# EAGLE design tag (EAGLE 9.0.0)
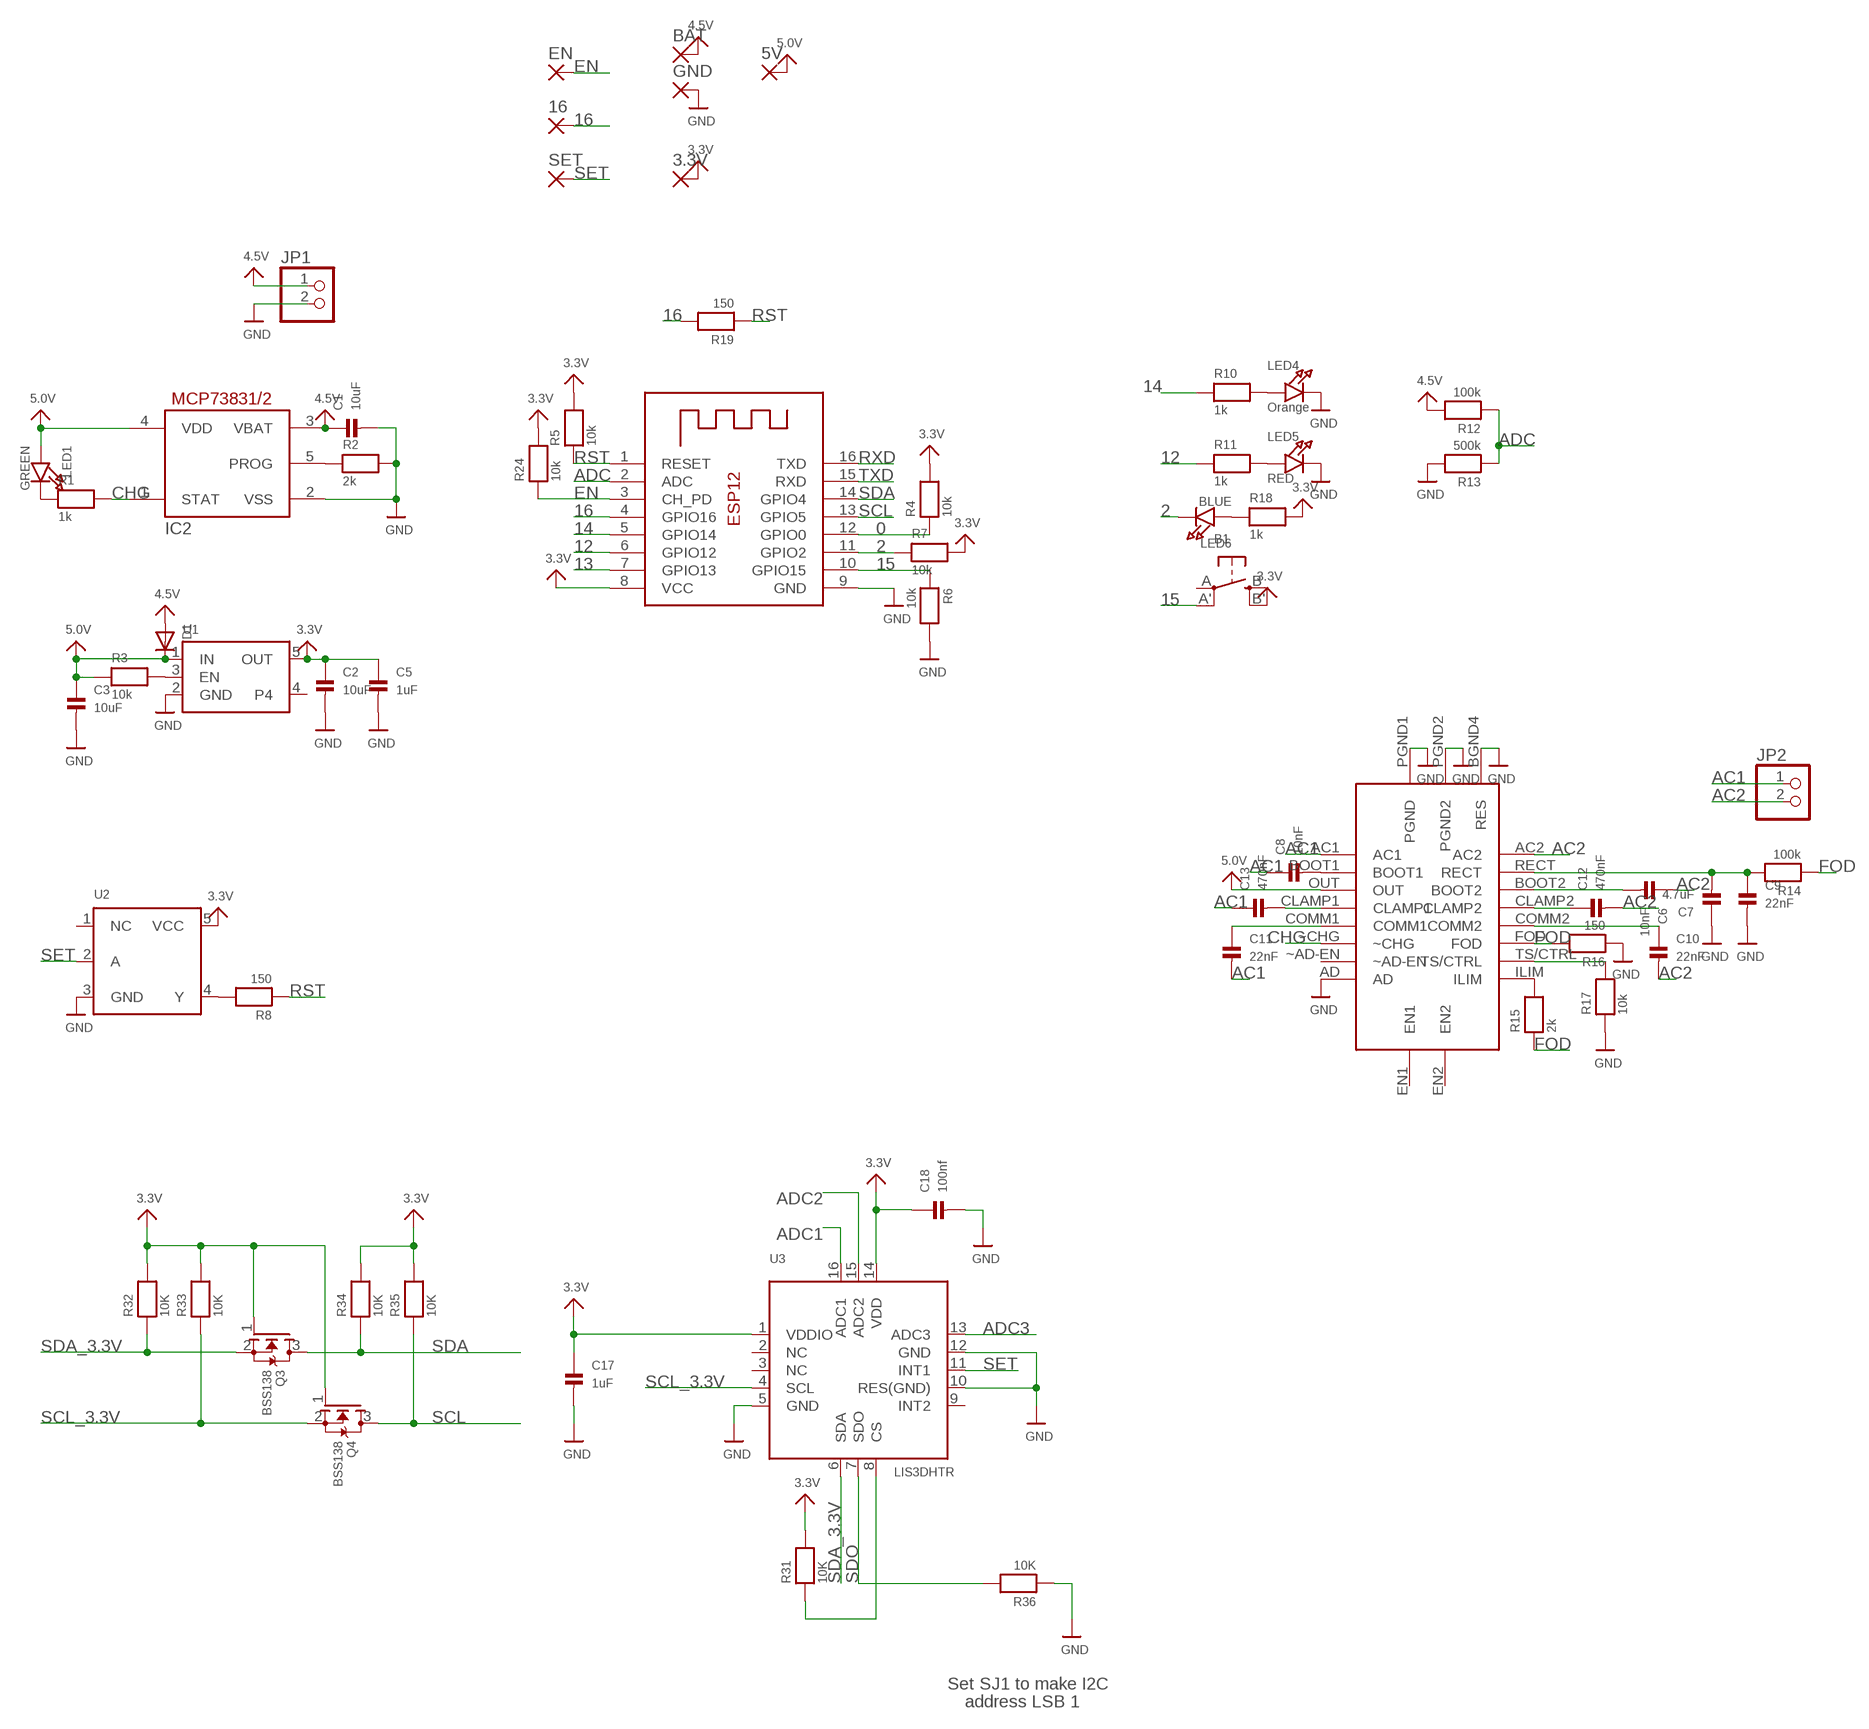
[diagram p0: schematic, sheet 1]

## Parts
3.3V  SMD2  [SMD1,27-2,54]
5V  SMD2  [SMD1,27-2,54]
16  SMD2  [SMD1,27-2,54]
B1  SWITCH_TACT_SMT4.6X2.8  [BTN_KMR2_4.6X2.8]
BAT  SMD2  [SMD1,27-2,54]
C1  10uF  CAP_CERAMIC0603  [0603]
C2  10uF  CAP_CERAMIC0603  [0603]
C3  10uF  CAP_CERAMIC0603  [0603]
C5  1uF  CAP_CERAMIC0402  [0402]
C6  10nF  CAP_CERAMIC0402  [0402]
C7  4.7uF  CAP_CERAMIC0603  [0603]
C8  10nF  CAP_CERAMIC0402  [0402]
C9  22nF  CAP_CERAMIC0402  [0402]
C10  22nF  CAP_CERAMIC0402  [0402]
C11  22nF  CAP_CERAMIC0402  [0402]
C12  470nF  CAP_CERAMIC0402  [0402]
C13  470nF  CAP_CERAMIC0402  [0402]
C17  1uF  CAP_CERAMIC0402  [0402]
C18  100nf  CAP_CERAMIC0402  [0402]
D1  DIODESOD-123  [SOD-123]
EN  SMD2  [SMD1,27-2,54]
GND  SMD2  [SMD1,27-2,54]
IC2  MCP73831/OT  [SOT23-5L]
JP1  HEADER-1X2  [1X02_OVAL]
JP2  HEADER-1X2  [1X02_OVAL]
LED1  GREEN  LED0603  [CHIPLED_0603]
LED4  Orange  LED0603  [CHIPLED_0603]
LED5  RED  LED0603  [CHIPLED_0603]
LED6  BLUE  LED0603  [CHIPLED_0603]
Q3  BSS138  MOSFET-NWIDE  [SOT23-WIDE]
Q4  BSS138  MOSFET-NWIDE  [SOT23-WIDE]
R1  1k  RESISTOR0402  [0402]
R2  2k  RESISTOR0402  [0402]
R3  10k  RESISTOR0402  [0402]
R4  10k  RESISTOR0402  [0402]
R5  10k  RESISTOR0402  [0402]
R6  10k  RESISTOR0402  [0402]
R7  10k  RESISTOR0402  [0402]
R8  150  RESISTOR0402  [0402]
R10  1k  RESISTOR0402  [0402]
R11  1k  RESISTOR0402  [0402]
R12  100k  RESISTOR0402  [0402]
R13  500k  RESISTOR0402  [0402]
R14  100k  RESISTOR0402  [0402]
R15  2k  RESISTOR0402  [0402]
R16  150  RESISTOR0402  [0402]
R17  10k  RESISTOR0402  [0402]
R18  1k  RESISTOR0402  [0402]
R19  150  RESISTOR0402  [0402]
R24  10k  RESISTOR0402  [0402]
R31  10K  RESISTOR0402  [0402]
R32  10K  RESISTOR0402  [0402]
R33  10K  RESISTOR0402  [0402]
R34  10K  RESISTOR0402  [0402]
R35  10K  RESISTOR0402  [0402]
R36  10K  RESISTOR0402  [0402]
SET  SMD2  [SMD1,27-2,54]
U1  VREG_SOT23-5  [SOT23-5]
U2  74LVC1G04  [SOT23-5]
U3  LIS3DHTR  ACCEL_LIS3DHTR  [LGA16_3X3MM]
U$1  BQ51013B  [VQFN]
X1  ESP-12  [ESP-12]

## Nets
0: R4.1 X1.12(GPIO0)
2: LED6.C R7.1 X1.11(GPIO2)
3.3V: 3.3V.1(P) B1.B'(S1) C2.1 C5.1 C17.1 C18.1 Q3.1(G) Q4.1(G) R4.2 R5.2 R7.2 R18.2 R24.2 R31.2 R32.2 R33.2 R34.2 R35.2 U1.5(OUT) U2.5(VCC) U3.1(VDDIO) U3.14(VDD) X1.8(VCC)
4.5V: BAT.1(P) C1.1 D1.A IC2.3(VBAT) JP1.1 R12.2
5.0V: 5V.1(P) C3.1 D1.C IC2.4(VDD) LED1.A R3.1 U1.1(IN) U$1.OUT
12: R11.1 X1.6(GPIO12)
13: X1.7(GPIO13)
14: R10.1 X1.5(GPIO14)
15: B1.A'(P1) R6.1 X1.10(GPIO15)
16: 16.1(P) R19.2 X1.4(GPIO16)
AC1: C8.1 C11.2 C13.1 JP2.1 U$1.AC1
AC2: C6.1 C10.2 C12.2 JP2.2 U$1.AC2
ADC: R12.1 R13.1 X1.2(ADC)
ADC1: U3.16(ADC1)
ADC2: U3.15(ADC2)
ADC3: U3.13(ADC3)
CHG: IC2.1(STAT) R1.2 U$1.~CHG
EN: EN.1(P) R24.1 X1.3(CH_PD)
FOD: R14.1 R15.1 R16.2 U$1.FOD
GND: C1.2 C2.2 C3.2 C5.2 C7.1 C9.2 C17.2 C18.2 GND.1(P) IC2.2(VSS) JP1.2 LED4.C LED5.C R2.2 R6.2 R13.2 R16.1 R17.1 R36.1 U1.2(GND) U2.3(GND) U3.5(GND) U3.10(RES(GND)) U3.12(GND) U$1.AD U$1.BGND4(RES) U$1.PGND1(PGND) U$1.PGND2 X1.9(GND)
N$1: C11.1 U$1.COMM1
N$2: LED1.C R1.1
N$3: IC2.5(PROG) R2.1
N$4: LED6.A R18.1
N$5: R3.2 U1.3(EN)
N$6: R8.2 U2.4(Y)
N$11: R31.1 U3.8(CS)
N$12: LED4.A R10.2
N$13: LED5.A R11.2
N$14: C8.2 U$1.BOOT1
N$15: C6.2 U$1.BOOT2
N$16: C7.2 C9.1 R14.2 U$1.RECT
N$17: R15.2 U$1.ILIM
N$18: R17.2 U$1.TS/CTRL
N$19: C10.1 U$1.COMM2
N$20: C13.2 U$1.CLAMP1
N$22: C12.1 U$1.CLAMP2
RST: R5.1 R8.1 R19.1 X1.1(RESET)
RXD: X1.16(TXD)
SCL: Q4.3(D) R35.1 X1.13(GPIO5)
SCL_3.3V: Q4.2(S) R33.1 U3.4(SCL)
SDA: Q3.3(D) R34.1 X1.14(GPIO4)
SDA_3.3V: Q3.2(S) R32.1 U3.6(SDA)
SDO: R36.2 U3.7(SDO)
SET: SET.1(P) U2.2(A) U3.11(INT1)
TXD: X1.15(RXD)
Unconnected: B1.A(P) B1.B(S) U1.4 U2.1(NC) U3.2(NC) U3.3(NC) U3.9(INT2) U$1.EN1 U$1.EN2 U$1.~AD-EN

## Notes on the sheet
- Set SJ1 to make I2C
- address LSB 1

## Library data of the parts
3.3V 5V 16 BAT EN GND SET = wirepad:SMD2: SMD PAD
B1 = microbuilder:SWITCH_TACT_SMT: SMT Tact Switches 6x6mm - Digikey: P12940SCT-ND KMR2 (4.6x2.8mm) - Digikey: 401-1426-1-ND EVQ-PQHB55 - Light Touch, 160GF (4.5x4.5mm) - Digikey: P8090SCT-ND
C1-C3 C5-C13 C17 C18 = microbuilder:CAP_CERAMIC: Ceramic Capacitors 0402 - 0402 Surface Mount Capacitors 16pF 50V 5% [Digikey: 445-4899-2-ND] 18pF 50V 5% [Digikey: 490-1281-2-ND] 22pF 50V 5% [Digikey: 490-1283-2-ND] 68pF 50V 5% [Digikey: 490-1289-2-ND] 0.1uF 10V 10% [Digikey: 490-1318-2-ND] 1.0uF 6.3V 10% [Digikey: 490-1320-2-ND] 0603 - 0603 Surface Mount Capacitors 16 pF 50V 5% [Digikey: 445-5051-2-ND] 22 pF 50V [Digikey: PCC220ACVTR-ND] 33 pF 50V 5% [Digikey: 490-1415-1-ND] 56pF 50V 5% [Digikey: 490-1421-1-ND] 220pF 50V 5% [Digikey: 445-1285-1-ND] 680 pF 50V 2200 pF 50V 5% C0G [Digikey: 445-1297-1-ND] 5600 pF 100V 5% X7R [Digikey: 478-3711-1-ND] 0.1 µF 25V 10% [Digikey: PCC2277TR-ND] 0.22 µF 16V 10% X7R [Digikey: 445-1318-1-ND] 1.0 µF 25V 10% [Digikey: 445-5146-2-ND] 0603 - RF Specific 3pF 250V +/-0.1pF RF [Digikey: 712-1347-1-ND] 18 pF 250V 5% [Digikey: 478-3505-1-ND or 712-1322-1-ND] 56 pF 250V 5% C0G RF [Digikey: 490-4867-1-ND] 68 pF 250V RF [Digikey: 490-4868-1-ND] 0805 - 0805 Surface Mount Capacitors 220 pF 250V 2% RF Ceramic Capacitor [Digikey: 712-1398-1-ND] 1000 pF 50V 2% NP0 Ceramic Capacitor [Digikey: 478-3760-1-ND] 0.1 µF 25V 10% Ceramic Capacitor [Digikey: PCC1828TR-ND] 1.0 µF 16V 10% Ceramic Capacitor[Digikey: 490-1691-2-ND] 10.0 µF 10V 10% Ceramic Capacitor[Digikey: 709-1228-1-ND] 10.0 uF 16V 10% Ceramic Capacitor [Digikey: 478-5165-2-ND] 47 uF 6.3V 20% Ceramic Capacitor [Digikey: 587-1779-1-ND or 399-5506-1-ND] 1206 - 1206 Surface Mount Capacitors 47uF 10V 20% Ceramic Capacitor [Digikey: 490-5528-1-ND or 399-5508-1-ND or 445-6010-1-ND] 100uF 6.3V -20%, +80% Y5V Ceramic Capacitor (Digikey: 490-4512-1-ND, Mouser: 81-GRM31CF50J107ZE1L)
D1 = adafruit:DIODE: Diode SMADIODE - SMA Surface Mount Package 20V 1A Schottky Diode Digikey: 641-1014-6-ND DO-1N4148 - Through Hole Small Current Diode SOD-123 20V 1 A (.5mV Vf) Schottky Diode - Digikey: MBRX120TPMSCT-ND SOD-323 10V 570mA (.38mV Vf, 3ns) Schottky Diode - Digikey: ZLLS410CT-ND SOD-523 30V 30mA Schottky Diode (RB751S-40TE61) - Digikey: RB751S-40TE61CT-ND SOT23-R/W - SOT23 Package (R = Solder Paste/Reflow Ovens, W = Hand-Soldering) BAT54Film 40V 300mA - Digikey: 497-7162-1-ND
IC2 = adafruit:MCP73831: MCP73831/2 Miniature Single-Cell, Fully Integrated Li-Ion, Li-Polymer Charge Management Controllers. Nice and small simple lipoly charge controller, with adjustable current and status output (LED) http://www.ladyada.net/library/pcb/eaglelibrary.html
JP1 JP2 = microbuilder:HEADER-1X2: PIN HEADER
LED1 LED4-LED6 = microbuilder:LED: LED 0603 - 0603 Surface Mount Package 2mA: Green LED - Low Power (3.9mcd, 2ma, 1.7Vf) - Digikey: 475-2709-2-ND Orange LED - Low Power (9.8mcd, 2ma, 1.8Vf) - Digikey: 475-1194-2-ND Red LED - Low Power (5mcd, 2ma, 1.8Vf) - Digikey: 475-1195-2-ND Yellow LED - Low Power (7mcd, 2ma, 1.8Vf) - Digikey: 475-1196-2-ND 5mA: Blue LED - Low Power (17mcd, 5ma, 2.9Vf) - Digikey: LNJ937W8CRACT-ND 0805 - 0805 Surface Mount Package 2mA: Red LED (8.8mcd, 2mA, 1.8Vf, Clear) - Low Power [Digikey: 475-2510-1-ND] Green LED (5mcd, 2mA, 1.8Vf, Clear) - Low Power [Digikey: 475-2730-1-ND] Yellow LED (11.3mcd, 2mA, 1.8Vf, Clear) - Low Power [Digikey: 475-2555-1-ND] 20mA: Red LED (104mcd, 20mA, Diffused) - LS R976 [Digikey: 475-1278-6-ND] Red LED (12mcd, 20mA, 2.0Vf, Clear) - APT2012EC [Digikey: 754-1128-1-ND] Green LED (15mcd, 20mA, 2.2Vf, Clear) - APT2012GC [Digikey: 754-1131-1-ND] Orange LED (160mcd, 20mA, 2.1Vf, Clear) - APT2012SECK [Digikey: 754-1130-1-ND] 1206 - 1206 Surface Mount Package Green LED (26mcd, 20mA, Diffused) - LG N971 [Digikey: 475-1407-6-ND] Red LED (15mcd, 20mA, Diffused) - LH N974 [Digikey: 475-1416-6-ND]
Q3 Q4 = microbuilder:MOSFET-N: N-Channel Mosfet LEGEND VDS: Voltage Drain-Source ID: Drain Current RDS(ON): Drain-Source On-State Resistance VGS(TH): Gate-Source Threshold Voltage CISS: Drain-Source Input Capacitance SOT-23 Name VDS ID RDS(ON) VGS(TH) CISS Order Number 2N7002E 60V 260mA 2.5 Ohm 2.5V @ 250uA 26.7pF @ 25V 2N7002ET1GOSTR-ND BSH103 30V 850mA 400 mOhm 400mV @ 1mA 83pF @ 24V BSH103,235-ND BSS138 60V 320mA 1.6 Ohm 1.5V @ 250uA 50pF @ 10V Mouser: 771-BSS138PW115 DMN2075U-7 20V 4.2A 38 mOhm 1V @ 250 uA 594.3pF @ 10V DMN2075U-7DICT-ND * BSS138 good choice for I2C level-shifting POWERPAK 1212-8 Name VDS ID RDS(ON) VGS(TH) CISS Order Number Si7308DN 60V 6A 58 mOhm 3V @ 250uA 665pF @ 15V SI7308DN-T1-E3CT-ND
R1-R8 R10-R19 R24 R31-R36 = microbuilder:RESISTOR: Resistors 0402 - 0402 Surface Mount Package 22 Ohm 1% 1/16W [Digikey: 311-22.0LRTR-ND] 33 Ohm 5% 1/16W 1.0K 5% 1/16W 1.5K 5% 1/16W 2.0K 1% 1/16W 10.0K 1% 1/16W [Digikey: 311-10.0KLRTR-ND] 10.0K 5% 1/16W [Digikey: RMCF0402JT10K0TR-ND] 12.1K 1% 1/16W [Digikey: 311-22.0LRTR-ND] 100.0K 5% 1/16W 0603 - 0603 Surface Mount Package 0 Ohm 1/10 Watt 1% Resistor 15 Ohm 1/10 Watt 1% Resistor 33 Ohm 1/10 Watt 1% Resistor 49.9 Ohm 1/10 Watt 1% Resistor 100 Ohm 1/10 Watt 1% Resistor 150 Ohm 1/10 Watt 1% Resistor 240 Ohm 1/10 Watt 1% Resistor 390 Ohm 1/10 Watt 1% Resistor 560 Ohm 1/10 Watt 1% Resistor 680 Ohm 1/10 Watt 1% Resistor 750 Ohm 1/10 Watt 1% Resistor 1.0K Ohm 1/10 Watt 1% Resistor 1.5K Ohm 1/10 Watt 1% Resistor 2.0K Ohm 1/10 Watt 1% Resistor 2.2K Ohm 1/10 Watt 1% Resistor 3.3K Ohm 1/10 Watt 1% Resistor 4.7K Ohm 1/10 Watt 1% Resistor 10.0K Ohm 1/10 Watt 1% Resistor 12.0K Ohm 1/10 Watt 1% Resistor 12.1K Ohm 1/10 Watt 1% Resistor 20.0K Ohm 1/10 Watt 1% Resistor 33.0K Ohm 1/10 Watt 1% Resistor 100.0K Ohm 1/10 Watt 1% Resistor 0805 - 0805 Surface Mount Package 0 Ohm 1/8 Watt 1% Resistor 33 Ohm 1/8 Watt 1% Resistor 100 Ohm 1/8 Watt 1% Resistor 150 Ohm 1/8 Watt 1% Resistor 200 Ohm 1/8 Watt 1% Resistor 240 Ohm 1/8 Watt 1% Resistor 330 Ohm 1/8 Watt 1% Resistor 390 Ohm 1/8 Watt 1% Resistor 470 Ohm 1/8 Watt 1% Resistor 1.0K Ohm 1/8 Watt 1% Resistor 1.5K Ohm 1/8 Watt 1% Resistor 2.0K Ohm 1/8 Watt 1% Resistor 4.7K Ohm 1/8 Watt 1% Resistor 5.1K Ohm 1/8 Watt 1% Resistor 5.6K Ohm 1/8 Watt 1% Resistor 10.0K Ohm 1/8 Watt 1% Resistor 22.0K Ohm 1/8 Watt 1% Resistor 33.0K Ohm 1/8 Watt 1% Resistor 100K Ohm 1/8 Watt 1% Resistor 1206 - 1206 Surface Mount Package 2012 - 2010 Surface Mount Package 0.11 Ohm 1/2 Watt 1% Resistor - Digikey: RHM.11UCT-ND
U1 = microbuilder:VREG_SOT23-5: SOT23-5 Fixed Voltage Regulators To better organise some of the SOT23-5 fixed voltage regulators in this library, this new part was created. Part Current Out V Out V In V Dropout Digikey Part No. ADP121 150mA 3.3V 3.4-5.5V 0.09V @ 150mA ADP121-AUJZ33R7CT-ND ADP121 150mA 3.0V 3.1-5.5V 0.09V @ 150mA ADP121-AUJZ30R7CT-ND ADP122 300mA 3.3V 3.4-5.5V 0.085V @ 300mA ADP122AUJZ-3.3-R7CT-ND ADP1712 300mA 3.3V 3.5-5.5V 0.17V @ 300mA ADP1712AUJZ-3.3-R7TR-ND AP7311 (Low Cost) 150mA 3.3V 3.5-6V 0.15V @ 150mA AP7311-33WG-7DICT-ND LD39015M18R 150mA 1.8V 1.9V-5.5V 0.08V @ 100mA 497-6977-1-ND MCP1824T-3302E/OT 300mA 3.3V 3.5V-6V 0.2V @ 300mA MCP1824T-3302E/OTCT-ND MIC5205-2.5YM5 TR 150mA 2.5V 2.7-16V 0.165V @ 150mA 576-1257-2-ND MIC5205-3.0YM5 TR 150mA 3.0V 3.2V-16V 0.165V @ 150mA 576-1258-2-ND MIC5205-3.3YM5 TR 150mA 3.3V 3.5V-16V 0.165V @ 150mA 576-1259-2-ND TPS780330220 150mA 3.3V+2.2V 3.6-5.5V 250mV Max 296-23332-1-ND TDA3663/N1,135 100mA 3.3V 3.5-45V 0.18V @ 50mA 568-5343-1-ND
U2 = microbuilder:74LVC1G04: 74LVC1G04 - Single Inverter Gate SOT23-5 SN74LVC1G04DBVR - Digikey: 296-11599-1-ND
U3 = microbuilder:ACCEL_LIS3DHTR: LIS3DHTR 3-Axis Accelerometer with I2C/SPI Interface VDD: 1.71-3.6V VDDIO: 1.71-VDD+0.1V Scale: +/-2g, 4g, 8g, 16g with 16--bit data output Temp:: -40°C - 85°C Mouser: 511-LIS3DHTR Digikey: 497-10613-1-ND
U$1 = masterthesis:BQ51013B
X1 = adafruit:ESP-12

## Board
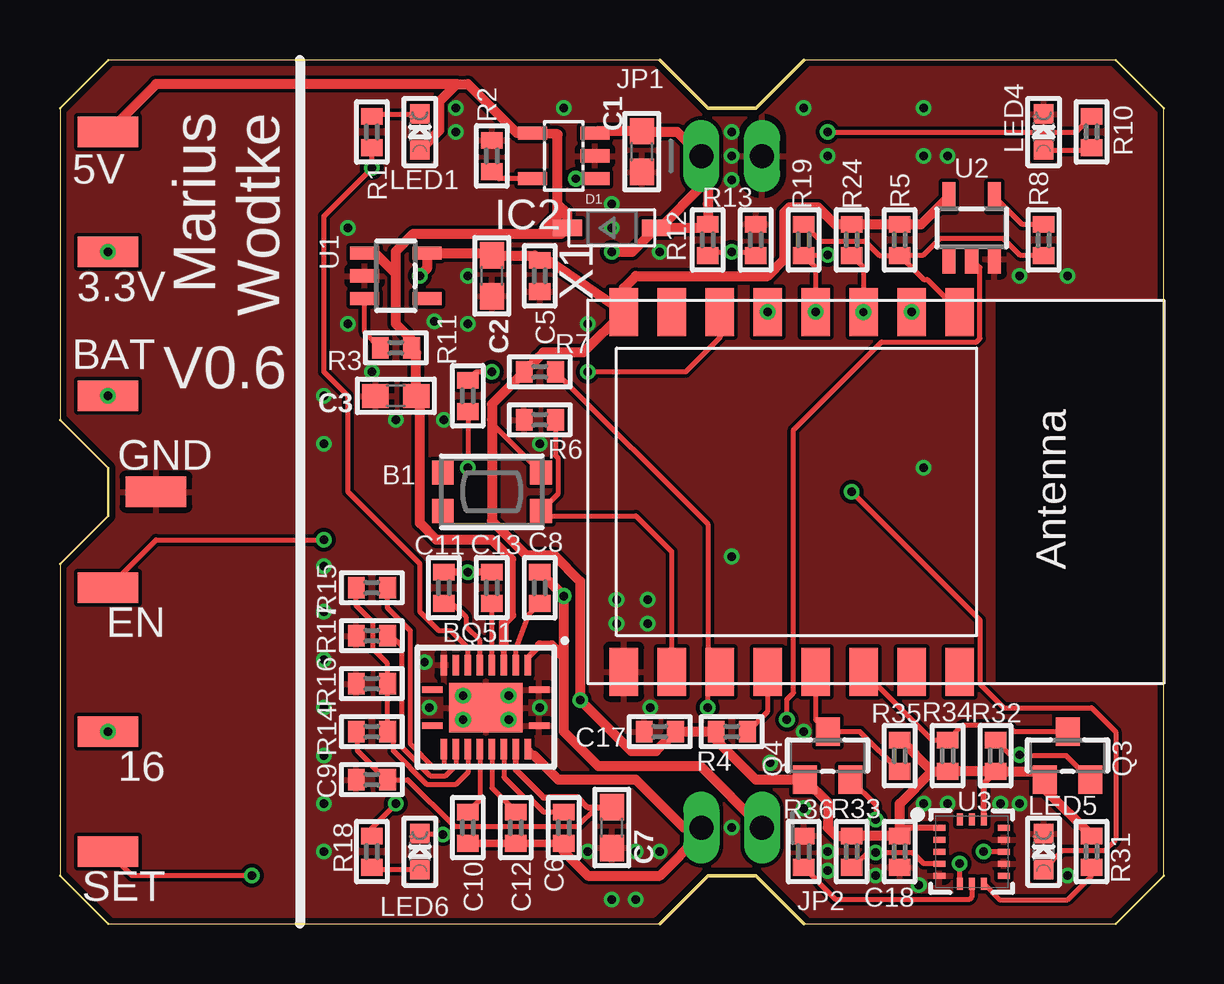
[diagram p1: board, top side]
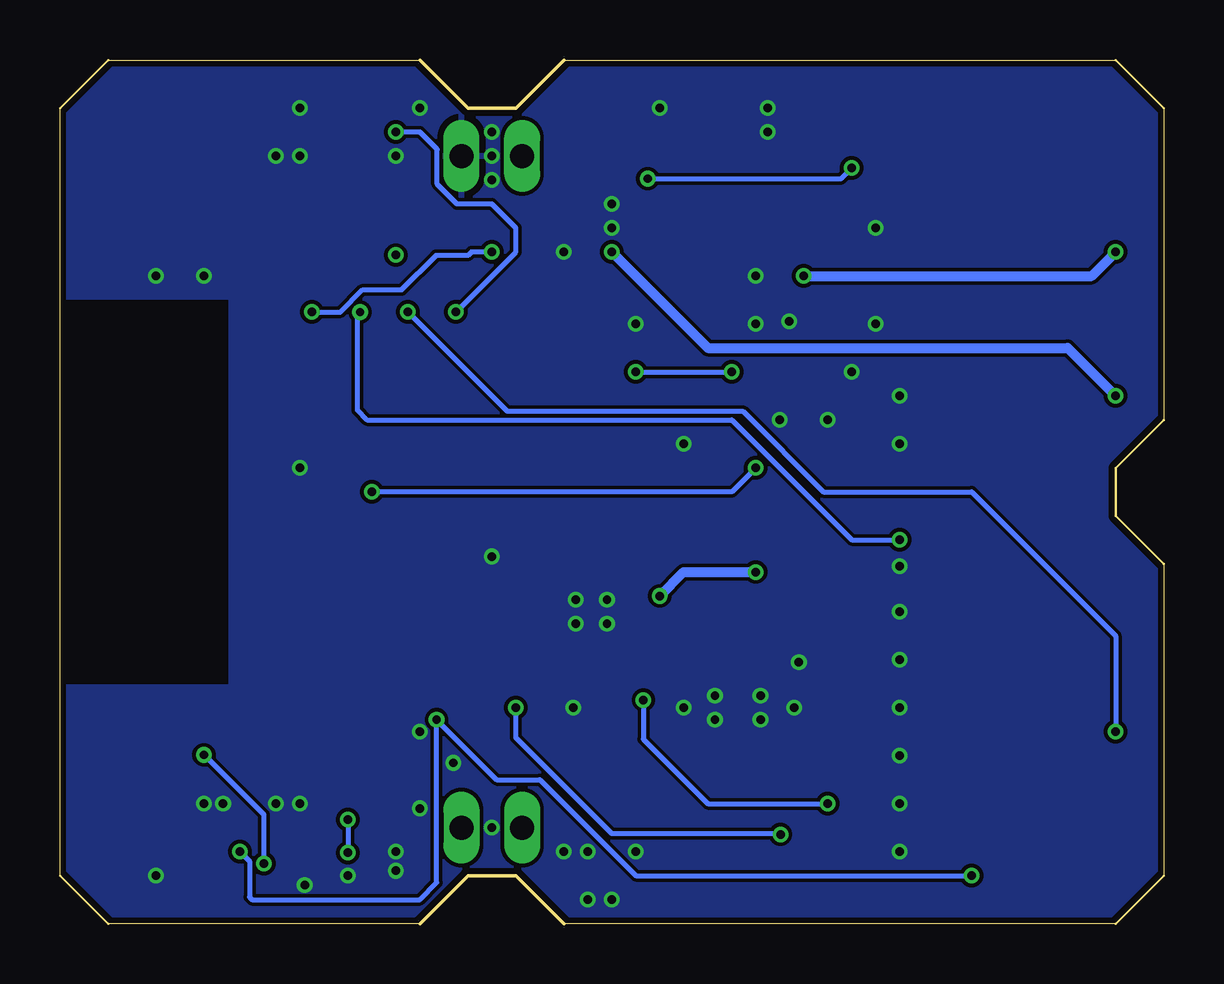
[diagram p2: board, bottom side, seen from below]

Size 46 x 36 mm. Coordinates in mm from the lower left corner, seen from the top.
Outline: 2,0 25,0 27,2 29,2 31,0 44,0 46,2 46,34 44,36 31,36 29,34 27,34 25,36 2,36 0,34 0,21 2,19 2,17 0,15 0,2 2,0
Copper layers (1*16): Top 0.035mm / dielectric 1.5mm / Bottom 0.035mm
Design rules "SeeedStudio_2layer_DRU_no_angle_20140221": minimum track width 6mil, minimum drill 12mil, track to track 6mil, track to pad 6mil, pad to pad 6mil, via to via 6mil, smd to smd 0mil, copper to edge 10mil, drill to drill 10mil, minimum pad ring 10mil, minimum via ring 6mil, stop-mask expansion 2mil, vias tented up to drill 100mil, thermal gap 10mil

### Footprints (pad centres in the part's own frame; a part is rotated, then mirrored left to right if it is on the bottom)
SMD1,27-2,54 = smd 1.27 x 2.54: 1 0,0
BTN_KMR2_4.6X2.8 = smd 0.9 x 1: A 2.05,0.8; A' -2.05,0.8; B 2.05,-0.8; B' -2.05,-0.8
0603 = smd 1.1 x 1: 1 -0.85,0; 2 0.85,0
0402 = smd 0.7 x 0.9: 1 -0.65,0; 2 0.65,0
SOD-123 = smd 1.2 x 0.7: A 1.85,0; C -1.85,0
SOT23-5L = smd 0.55 x 1.2: 1 -0.95,-1.3; 2 0,-1.3; 3 0.95,-1.3; 4 0.95,1.3; 5 -0.95,1.3
1X02_OVAL = drill 1 long: 1 -1.27,0; 2 1.27,0
CHIPLED_0603 = smd 0.8 x 0.8: A 0,-0.75; C 0,0.75
SOT23-WIDE = smd 1 x 1.2: 1 -0.95,-1; 2 0.95,-1; 3 0,1
SOT23-5 = smd 0.55 x 1.2: 1 -0.95,-1.3; 2 0,-1.3; 3 0.95,-1.3; 4 0.95,1.3; 5 -0.95,1.3
LGA16_3X3MM = smd 0.5 x 0.25: 1 -1.35,1; 2 -1.35,0.5; 3 -1.35,0; 4 -1.35,-0.5; 5 -1.35,-1; 9 1.35,-1; 10 1.35,-0.5; 11 1.35,0; 12 1.35,0.5; 13 1.35,1 | smd 0.25 x 0.5: 6 -0.5,-1.35; 7 0,-1.35; 8 0.5,-1.35; 14 0.5,1.35; 15 0,1.35; 16 -0.5,1.35
VQFN = smd 0.28 x 0.85: AC1 -1.5,-1.775; AC2 -1.5,1.725; AD 2,-1.775; BOOT1 -1,-1.775; BOOT2 -0.5,1.725; CLAMP1 0,-1.775; CLAMP2 0,1.725; COMM1 0.5,-1.775; COMM2 0.5,1.725; FOD 1,1.725; ILIM 2,1.725; OUT -0.5,-1.775; RECT -1,1.725; TS/CTRL 1.5,1.725; ~AD-EN 1.5,-1.775; ~CHG 1,-1.775 | smd 3.05 x 2.05: BGND4 0.25,0 | smd 0.85 x 0.28: EN1 2.475,-0.75; EN2 2.475,0.75; PGND1 -1.975,-0.75; PGND2 -1.975,0.75
ESP-12 = smd 2 x 1.2: 1 -7.5,4.5; 2 -7.5,2.5; 3 -7.5,0.5; 4 -7.5,-1.5; 5 -7.5,-3.5; 6 -7.5,-5.5; 7 -7.5,-7.5; 8 -7.5,-9.5; 9 7.5,-9.5; 10 7.5,-7.5; 11 7.5,-5.5; 12 7.5,-3.5; 13 7.5,-1.5; 14 7.5,0.5; 15 7.5,2.5; 16 7.5,4.5

### Placement (x,y rotation side)
3.3V  2,28 90 top
5V  2,33 90 top
16  2,8 90 top
B1  18,18 180 top
BAT  2,22 90 top
C1  24.25,32.18 270 top
C2  18,27 270 top
C3  14,22 180 top
C5  20,27 270 top
C6  21,4 90 top
C7  23,4 90 top
C8  20,14 270 top
C9  13,6 180 top
C10  17,4 270 top
C11  16,14 90 top
C12  19,4 270 top
C13  18,14 270 top
C17  25,8 180 top
C18  35,3 270 top
D1  23,29 0 top
EN  2,14 90 top
GND  4,18 90 top
IC2  21,32 90 top
JP1  28,32 0 top
JP2  28,4 180 top
LED1  15,33 0 top
LED4  41,33 0 top
LED5  41,3 0 top
LED6  15,3 0 top
Q3  42,7 0 top
Q4  32,7 0 top
R1  13,33 270 top
R2  18,32 90 top
R3  14,24 180 top
R4  28,8 180 top
R5  35,28.5 90 top
R6  20,21 180 top
R7  20,23 180 top
R8  41,28.5 90 top
R10  43,33 270 top
R11  17,22 270 top
R12  27,28.5 90 top
R13  29,28.5 90 top
R14  13,8 180 top
R15  13,14 0 top
R16  13,10 0 top
R17  13,12 0 top
R18  13,3 90 top
R19  31,28.5 270 top
R24  33,28.5 90 top
R31  43,3 90 top
R32  39,7 270 top
R33  33,3 90 top
R34  37,7 270 top
R35  35,7 90 top
R36  31,3 270 top
SET  2,3 90 top
U1  14,27 270 top
U2  38,29 0 top
U3  38,3 0 top
U$1  18,9 180 top
X1  33,18 270 top

### Tracks (layer width: path | path; a pad name or v marks a point on that pad's centre or on a via)
0
  Top 0.203: R4.1 29.5,8.85 X1.12
2  (via drill 0.35)
  Top 0.203: v15.96,3.71 15.04,3.71 LED6.C | R7.1 27,16.65 27,11 | 27,11 X1.11 | v27,9 27,11
  Bottom 0.203: v15.96,3.71 16,3.75 23,3.75 27,7.75 v27,9
3.3V  (via drill 0.35)
  Top 0.203: v14,5 13,4 R18.2 | B1.B' 18,20.85 18,21
  Top 0.254: U3.14 38.5,5.85 R32.2 | U3.1 35,4
  Top 0.305: 30.25,29 30.25,29.63 30.42,29.8 31.58,29.8 32.23,29.15 R24.2 33.35,29.15
  Top 0.406: X1.8 20.35,27.65 C5.1 19.8,27.85 C2.1 17.9,27.95 U1.5 15.3,27.3 v15,27 | R31.2 41.05,5.6 Q3.1 40.7,6.35 R32.2 R34.2 36.35,6.35 | 36.35,6.35 35,5 35,4 C18.1 R33.2 32.35,3.65 32,4 32,5.05 Q4.1 29,6 27.35,7.65 R4.2 C17.1 | 36.35,6.35 35.05,7.65 R35.2 | C17.1 | X1.8 21.81,23.81 20.15,23.81 19.94,23.6 19.94,23.59 R7.2 18,21.65 18,21 18,16.79 19.43,15.36 20.6,15.36 21.68,14.27 v21.68,9.32 23.81,7.19 24.85,7.19 C17.1 | X1.8 23.5,26.5 24,27 29.5,27 30.19,27.69 30.19,29.65 30.4,29.86 31.6,29.86 32.3,29.15 R24.2 R5.2 35.9,29.15 U2.5
  Bottom 0.203: v14,5 19,5 21.68,7.68 v21.68,9.32
  Bottom 0.406: v15,27 3,27 3.3V.1
  other vias: 2,28
4.5V  (via drill 0.35)
  Top 0.152: 25,29 25.35,29
  Top 0.203: 25,29 D1.A
  Top 0.406: D1.A 23.85,28 v23,28 | IC2.3 22.38,33.03 C1.1 24.28,33 25.73,33 JP1.1 | JP1.1 27,31.73 27,30 R12.2 26.85,29 25,29 26.73,30.73 JP1.1
  Bottom 0.406: BAT.1 4,24 19,24 v23,28
  other vias: 2,22
5.0V
  Top 0.254: U$1.OUT 18.5,11.5
  Top 0.406: 20.75,30 20.75,32.9 IC2.4 19.05,32.95 17,35 16.53,35 | 5V.1 4,35 16.53,35 | 14.92,32.17 LED1.A 15.82,33.07 15.82,34.28 16.53,35 | 20,28.76 14.73,28.76 14,28.03 14,27.08 | 20,28.76 20.91,28.76 D1.C 21.15,29.6 20.75,30 | 20,28.76 20.75,29.51 20.75,30 | 18.5,11.5 18.5,12.55 18.81,12.85 18.81,15.19 18,16 15.7,16 15,16.7 15,21.85 C3.1 14.85,23.8 R3.1 14.65,24.35 14,25 14,27.08 | 14,27.08 13.13,27.95 U1.1
12  (via drill 0.35)
  Top 0.203: X1.6 27.5,24.42 26.08,23 v22,23 | v18,23 17.35,23 R11.1
  Bottom 0.203: v22,23 v18,23
14  (via drill 0.35)
  Top 0.203: v32,33 42.35,33 R10.1
  Bottom 0.203: X1.5 27,28 27,29 28,30 29.45,30 30.28,30.83 30.28,32.28 31,33 v32,33
  other vias: 29.5,25.5
15
  Top 0.203: 20.12,17.12 B1.A' 20.75,17.9 20.75,19.41 20.65,19.51 R6.1 | 20.12,17.12 20.25,17 24,17 25.5,15.5 X1.10 | 20.12,17.42 20.12,17.12
16  (via drill 0.35)
  Top 0.203: 31.5,26.45 X1.4 31.5,27.35 R19.2 31.02,27.87 v32,27.87
  Bottom 0.203: X1.4 27.36,21.36 17.53,21.36 14.18,18 8,18 2,12 16.1
  other vias: 31.5,25.5 2,8
AC1  (via drill 0.35)
  Top 0.254: U$1.AC1 19.5,11.1 20,11.6
  Top 0.305: C13.1 v17,14.65 C11.2
  Top 0.406: 21,11.1 21,8 22.44,6.56 26.71,6.56 JP2.1 | C8.1 20.59,14.06 20.6,14.06 v21,13.65 21,11.1 | 20,11.6 20.5,11.6 21,11.1
  Bottom 0.406: v21,13.65 C8.1 v17,14.65
AC2
  Top 0.254: 19.77,7 U$1.AC2
  Top 0.305: C6.1 C12.2 C10.2
  Top 0.406: C6.1 21,3 22,2 25,2 26.73,3.73 JP2.2 26,4 24,6 20.77,6 19.77,7
ADC  (via drill 0.35)
  Top 0.203: R12.1 27.15,28 v28,28 28.85,28 R13.1
  Bottom 0.203: X1.2 34.3,25.5 33.38,26.42 31.76,26.42 30.33,27.85 R13.1 28.85,28 v28,28
  other vias: 35.5,25.5
CHG  (via drill 0.35)
  Top 0.203: U$1.~CHG 17,11.5 16.3,12.2 15.8,12.2 15,13 15,15 12,18 12,22 11,23 11,29.5 v13,31.5 R1.2 | IC2.1 v21.5,31.05
  Bottom 0.203: v13,31.5 13.45,31.05 v21.5,31.05
EN  (via drill 0.35)
  Top 0.203: EN.1 4,16 v11,16 | v33.49,25.49 X1.3 33.5,27.35 R24.1
  Bottom 0.203: v33.49,25.49 33.6,25.38 33.6,21.4 33.2,21 18,21 13,16 v11,16
FOD
  Top 0.203: R15.1 12.35,13.25 13.05,12.55 13.05,11.45 13.65,10.84 R16.2 R14.1 13.9,7.75 13.9,7.2 15.3,5.79 16.49,5.79 17,6.3 U$1.FOD
GND  (via drill 0.35)
  other vias: 37,32 36,32 21,34 16.5,34 12,29 22,25 24.6,9 23.2,12.5 24,3 18.7,9.5 16.8,9.5 15.4,9 20,9 15.2,10.9 11,9 11,11 22,3 40,27 32,32 23.2,13.5 11,13 28,33 28,32 42,27 36,34 17,27 23,29 23,30 11,7 28,31 31,34 24.5,12.5 16.8,8.5 28,15.3 11,3 11,5 14,21 13,23 11,14.9 11,22 12,25 15.6,25.1 11,20 20,20 25,28 18.7,8.5 16,21 17,25 16.5,33 24.5,13.5 36,19 25,3 31,4.8 32,3 32,2.2 34,2 40,5 42,2 39.2,5 35.8,1.6 36,5 37,5 23,1 24,1 28,4 31,8 29.6,6.7
  pour Bottom: -1,37 47,37 47,-1 -1,-1
  pour Top: 47,37 -1,37 -1,-1 47,-1
N$1
  Top 0.203: U$1.COMM1 17.5,11.8 16.94,12.35 16.94,12.76 16.35,13.35 C11.1
N$2
  Top 0.203: R1.1 13.1,33.75 LED1.C
N$3
  Top 0.203: IC2.5 18.3,31.05 R2.1
N$4
  Top 0.203: LED6.A 13.1,2.25 R18.1
N$5
  Top 0.203: R3.2 12.7,24.65 U1.3
N$6
  Top 0.203: U2.4 40.1,29.15 R8.2
N$11
  Top 0.203: U3.8 39.15,1 42,1 43,2 R31.1
N$12
  Top 0.203: LED4.A 42.9,32.25 R10.2
N$13  (via drill 0.35)
  Top 0.203: LED5.A 41.8,3.05 43.55,3.05 44,3.49 44,8 43,9 39.35,9 38.35,10 38.35,12.65 v33,18 | R11.2 v17,19
  Bottom 0.203: v17,19 18,18 v33,18
N$14
  Top 0.203: C8.2 19.56,12.91 19,11.47 U$1.BOOT1
N$15
  Top 0.203: U$1.BOOT2 18.5,6.1 19.35,5.25 19.55,5.25 20.16,4.65 C6.2
N$16
  Top 0.203: R14.2 12.4,7.95 12.4,7.2 13.6,6 C9.1 14.49,6 16.45,4.05 21.55,4.05 22.36,4.85 C7.2 | 21.55,5.25 20.15,5.25
  Top 0.254: U$1.RECT 19,6.4 20.15,5.25 20.41,5.25 20.43,5.28 21.57,5.28 22,4.85 C7.2
N$17
  Top 0.203: 16,6.9 U$1.ILIM 16,6.6 15.9,6.5 15.6,6.5 14.61,7.49 14.61,12.2 13.65,13.16 R15.2
N$18
  Top 0.203: R17.2 13.81,12 14.25,11.55 14.25,7.34 15.45,6.14 16.05,6.14 16.5,6.6 U$1.TS/CTRL
N$19
  Top 0.203: C10.1 17.5,5.15 U$1.COMM2
N$20
  Top 0.203: U$1.CLAMP1 C13.2
N$22
  Top 0.203: U$1.CLAMP2 18,5.65 C12.1
RST
  Top 0.203: R19.1 31.7,28.45 33.55,28.45 34.16,27.85 R5.1 | R5.1 36,26.85 36.15,26.85 X1.1 | R8.1 40.03,27.85 39.33,28.55 36.67,28.55 35.97,27.85 R5.1
SCL
  Top 0.203: 31.54,10.5 X1.13 31.5,8.5 Q4.3 33.35,8 R35.1
SCL_3.3V  (via drill 0.35)
  Top 0.203: U3.4 36.01,2.5 35.55,2.95 v34,2.95 33.7,2.95 R33.1 | Q4.2 34,4.95 v34,4.33
  Bottom 0.203: v34,4.33 v34,2.95
SDA
  Top 0.203: Q3.3 39.81,8 39.55,8.25 37.6,8.25 R34.1 36.35,7.65 X1.14
SDA_3.3V  (via drill 0.35)
  Top 0.203: Q3.2 41.95,7 40,7 | R32.1 39.65,7 40,7 | U3.6 v37.5,2.5 | v40,7.03 40,7
  Bottom 0.203: v37.5,2.5 37.5,4.53 v40,7.03
SDO
  Top 0.203: U3.7 38,1.1 37.9,1 32.35,1 R36.2
SET  (via drill 0.35)
  Top 0.203: 8.19,2 v8,2 3,2 SET.1 | U3.11 v38.5,3 | v30.3,8.5 30.3,9.34 30.58,9.62 30.58,20.58 34.25,24.25 38.2,24.25 38.35,24.39 38.35,27.35 U2.2
  Bottom 0.203: v38.5,3 38.1,2.6 38.1,1.1 38,1 31,1 30.3,1.7 v30.3,8.5 27.8,6 26,6 22,2 v8,2

### Text on the board
tNames: Marius / Wodtke | V0.6